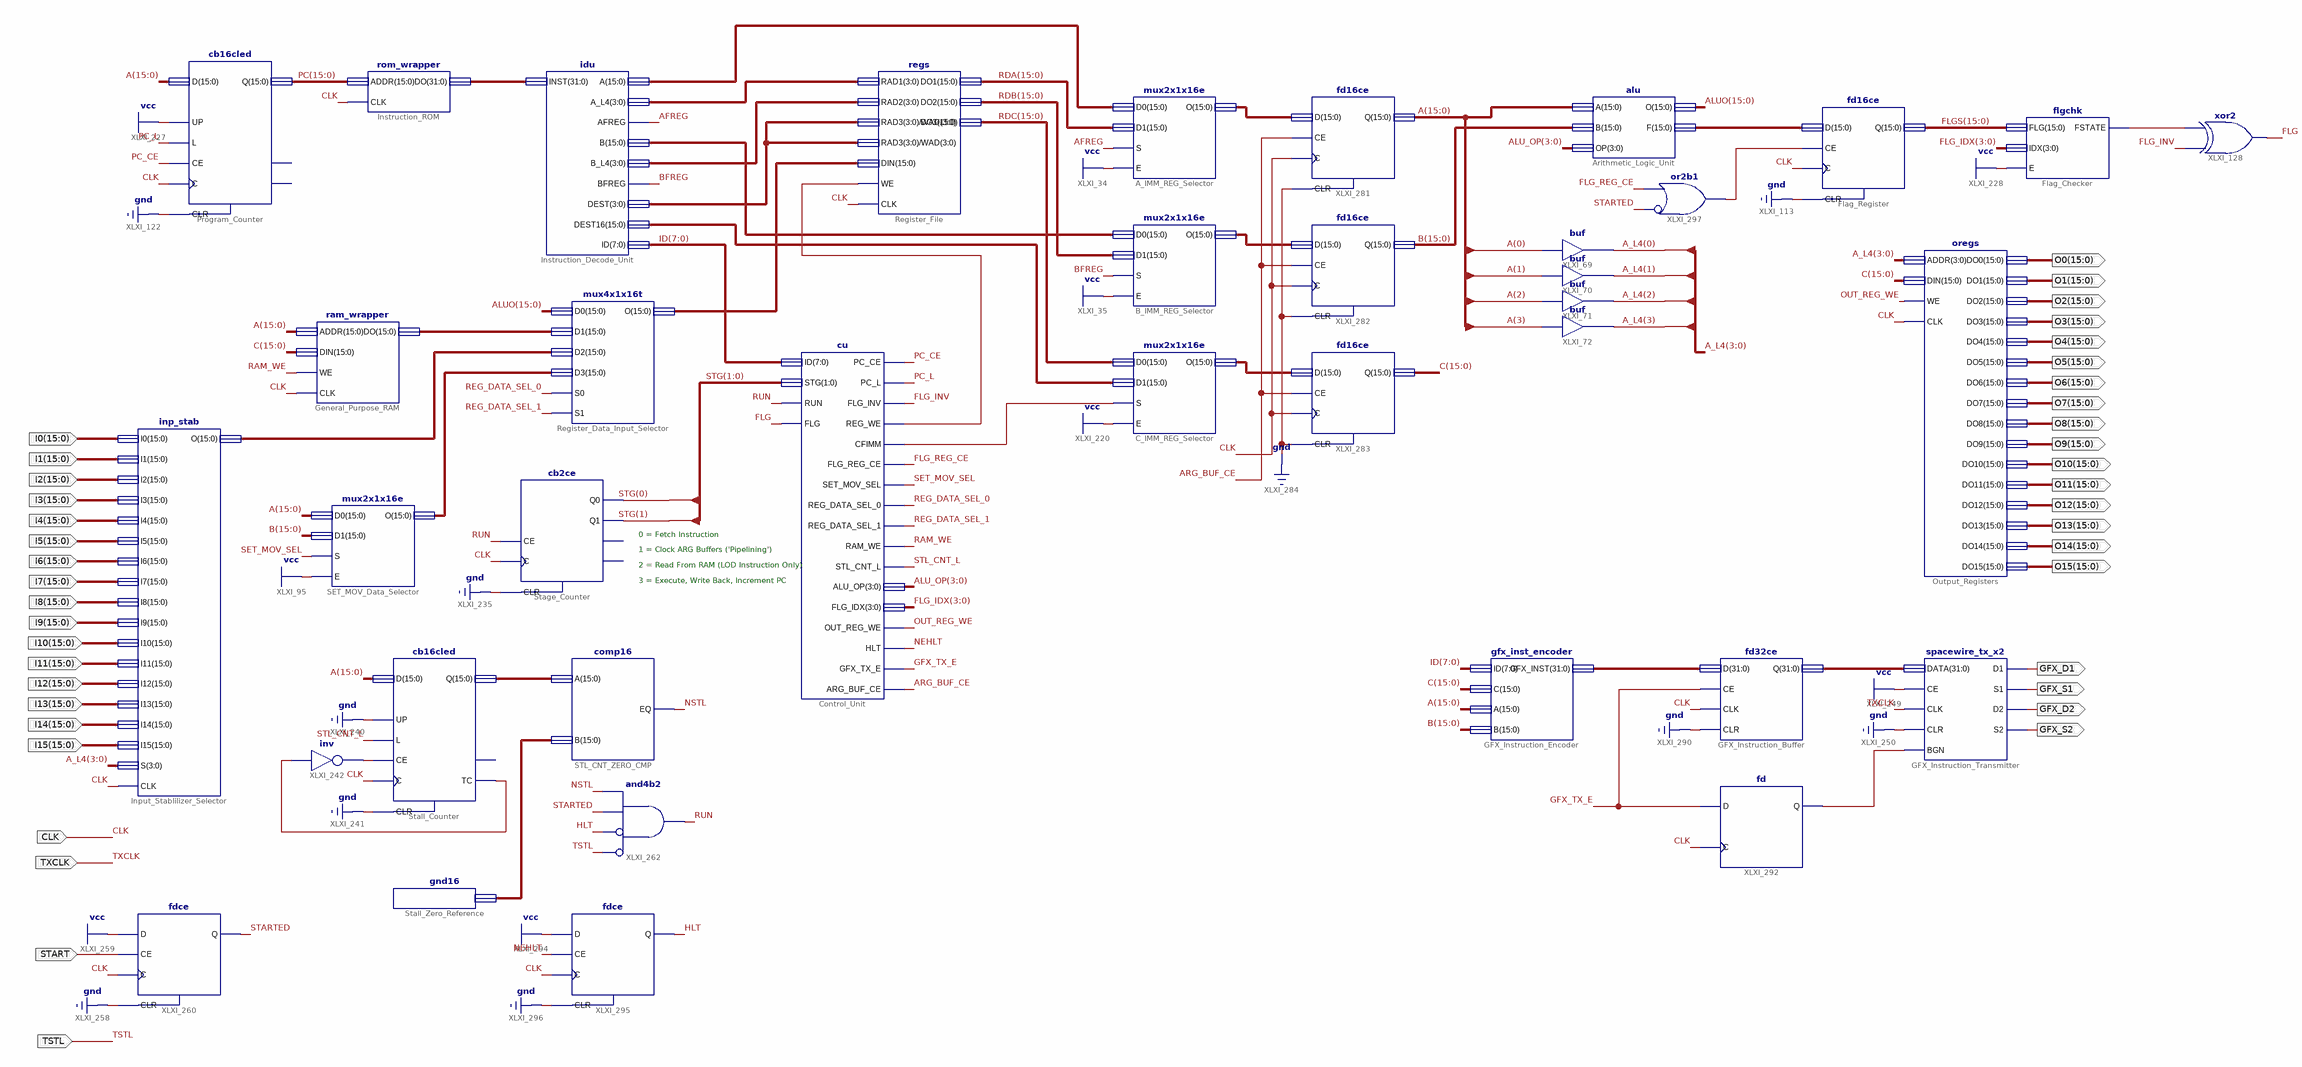
[diagram p0: schematic sheet 1]
// Xilinx ISE schematic cpu.sch (spartan6) as structural Verilog: 37 symbols, 42 ports
module cpu (
  input  [15:0] I0,
  input  [15:0] I1,
  input  [15:0] I10,
  input  [15:0] I11,
  input  [15:0] I12,
  input  [15:0] I13,
  input  [15:0] I14,
  input  [15:0] I15,
  input  [15:0] I2,
  input  [15:0] I3,
  input  [15:0] I4,
  input  [15:0] I5,
  input  [15:0] I6,
  input  [15:0] I7,
  input  [15:0] I8,
  input  [15:0] I9,
  input  CLK,
  input  TXCLK,
  input  START,
  input  TSTL,
  output [3:0] FLG_IDX,
  output [15:0] O0,
  output [15:0] O1,
  output [15:0] O10,
  output [15:0] O11,
  output [15:0] O12,
  output [15:0] O13,
  output [15:0] O14,
  output [15:0] O15,
  output [15:0] O2,
  output [15:0] O3,
  output [15:0] O4,
  output [15:0] O5,
  output [15:0] O6,
  output [15:0] O7,
  output [15:0] O8,
  output [15:0] O9,
  output GFX_S2,
  output GFX_D2,
  output GFX_S1,
  output GFX_D1,
  output [15:0] FLGS
);

  wire AFREG, ARG_BUF_CE, BFREG, FLG, FLG_INV, FLG_REG_CE, GFX_TX_E, HLT, NEHLT, NSTL, OUT_REG_WE, PC_CE,
       PC_L, RAM_WE, REG_DATA_SEL_0, REG_DATA_SEL_1, RUN, SET_MOV_SEL, STARTED, STL_CNT_L, XLXN_370,
       XLXN_696, XLXN_697, XLXN_728, XLXN_729, XLXN_848, XLXN_855;
  wire [1:0] STG;
  wire [3:0] A_L4, ALU_OP, XLXN_296, XLXN_303, XLXN_344;
  wire [7:0] ID;
  wire [15:0] A, ALUO, B, C, PC, RDA, RDB, RDC, XLXN_1, XLXN_30, XLXN_32, XLXN_58, XLXN_59, XLXN_60,
       XLXN_307, XLXN_348, XLXN_687, XLXN_762, XLXN_817, XLXN_818, XLXN_819;
  wire [31:0] XLXN_86, XLXN_837, XLXN_849;

  mux2x1x16e A_IMM_REG_Selector (.D0(XLXN_30), .D1(RDA), .E(1'b1), .O(XLXN_819), .S(AFREG));
  mux2x1x16e B_IMM_REG_Selector (.D0(XLXN_32), .D1(RDB), .E(1'b1), .O(XLXN_818), .S(BFREG));
  regs Register_File (
    .CLK(CLK), .DIN(XLXN_307), .DO1(RDA), .DO2(RDB), .DO3(RDC), .RAD1(XLXN_296), .RAD2(XLXN_303),
    .RAD3(XLXN_344), .WAD(XLXN_344), .WE(XLXN_728));
  mux2x1x16e C_IMM_REG_Selector (.D0(RDC), .D1(XLXN_348), .E(1'b1), .O(XLXN_817), .S(XLXN_729));
  cb16cled Program_Counter (.C(CLK), .CE(PC_CE), .CLR(1'b0), .D(A), .L(PC_L), .UP(1'b1), .Q(PC));  // open: CEO, TC
  idu Instruction_Decode_Unit (
    .A(XLXN_30), .AFREG(AFREG), .A_L4(XLXN_296), .B(XLXN_32), .BFREG(BFREG), .B_L4(XLXN_303),
    .DEST(XLXN_344), .DEST16(XLXN_348), .ID(ID), .INST(XLXN_86));
  mux4x1x16t Register_Data_Input_Selector (
    .D0(ALUO), .D1(XLXN_58), .D2(XLXN_59), .D3(XLXN_60), .O(XLXN_307), .S0(REG_DATA_SEL_0),
    .S1(REG_DATA_SEL_1));
  mux2x1x16e SET_MOV_Data_Selector (.D0(A), .D1(B), .E(1'b1), .O(XLXN_60), .S(SET_MOV_SEL));
  cb2ce Stage_Counter (.C(CLK), .CE(RUN), .CLR(1'b0), .Q0(STG[0]), .Q1(STG[1]));  // open: CEO, TC
  cb16cled Stall_Counter (
    .C(CLK), .CE(XLXN_696), .CLR(1'b0), .D(A), .L(STL_CNT_L), .UP(1'b0), .Q(XLXN_687), .TC(XLXN_697));  // open: CEO
  not XLXI_242 (XLXN_696, XLXN_697);
  comp16 STL_CNT_ZERO_CMP (.A(XLXN_687), .B(XLXN_762), .EQ(NSTL));
  gnd16 Stall_Zero_Reference (.GNDO(XLXN_762));
  fdce XLXI_260 (.C(CLK), .CE(START), .CLR(1'b0), .D(1'b1), .Q(STARTED));
  and XLXI_262 (RUN, ~TSTL, ~HLT, STARTED, NSTL);  // and4b2
  inp_stab Input_Stablilizer_Selector (
    .CLK(CLK), .I0(I0), .I1(I1), .I10(I10), .I11(I11), .I12(I12), .I13(I13), .I14(I14), .I15(I15), .I2(I2),
    .I3(I3), .I4(I4), .I5(I5), .I6(I6), .I7(I7), .I8(I8), .I9(I9), .O(XLXN_59), .S(A_L4));
  rom_wrapper Instruction_ROM (.ADDR(PC), .CLK(CLK), .DO(XLXN_86));
  ram_wrapper General_Purpose_RAM (.ADDR(A), .CLK(CLK), .DIN(C), .DO(XLXN_58), .WE(RAM_WE));
  alu Arithmetic_Logic_Unit (.A(A), .B(B), .F(XLXN_1), .O(ALUO), .OP(ALU_OP));
  fd16ce Flag_Register (.C(CLK), .CE(XLXN_855), .CLR(1'b0), .D(XLXN_1), .Q(FLGS));
  flgchk Flag_Checker (.E(1'b1), .FLG(FLGS), .FSTATE(XLXN_370), .IDX(FLG_IDX));
  xor XLXI_128 (FLG, FLG_INV, XLXN_370);
  oregs Output_Registers (
    .ADDR(A_L4), .CLK(CLK), .DIN(C), .DO0(O0), .DO1(O1), .DO10(O10), .DO11(O11), .DO12(O12), .DO13(O13),
    .DO14(O14), .DO15(O15), .DO2(O2), .DO3(O3), .DO4(O4), .DO5(O5), .DO6(O6), .DO7(O7), .DO8(O8), .DO9(O9),
    .WE(OUT_REG_WE));
  fd16ce XLXI_281 (.C(CLK), .CE(ARG_BUF_CE), .CLR(1'b0), .D(XLXN_819), .Q(A));
  fd16ce XLXI_282 (.C(CLK), .CE(ARG_BUF_CE), .CLR(1'b0), .D(XLXN_818), .Q(B));
  fd16ce XLXI_283 (.C(CLK), .CE(ARG_BUF_CE), .CLR(1'b0), .D(XLXN_817), .Q(C));
  cu Control_Unit (
    .ALU_OP(ALU_OP), .ARG_BUF_CE(ARG_BUF_CE), .CFIMM(XLXN_729), .FLG(FLG), .FLG_IDX(FLG_IDX),
    .FLG_INV(FLG_INV), .FLG_REG_CE(FLG_REG_CE), .GFX_TX_E(GFX_TX_E), .HLT(NEHLT), .ID(ID),
    .OUT_REG_WE(OUT_REG_WE), .PC_CE(PC_CE), .PC_L(PC_L), .RAM_WE(RAM_WE), .REG_DATA_SEL_0(REG_DATA_SEL_0),
    .REG_DATA_SEL_1(REG_DATA_SEL_1), .REG_WE(XLXN_728), .RUN(RUN), .SET_MOV_SEL(SET_MOV_SEL), .STG(STG),
    .STL_CNT_L(STL_CNT_L));
  fd32ce GFX_Instruction_Buffer (.CE(GFX_TX_E), .CLK(CLK), .CLR(1'b0), .D(XLXN_837), .Q(XLXN_849));
  gfx_inst_encoder GFX_Instruction_Encoder (.A(A), .B(B), .C(C), .GFX_INST(XLXN_837), .ID(ID));
  fd XLXI_292 (.C(CLK), .D(GFX_TX_E), .Q(XLXN_848));
  fdce XLXI_295 (.C(CLK), .CE(NEHLT), .CLR(1'b0), .D(1'b1), .Q(HLT));
  or XLXI_297 (XLXN_855, ~STARTED, FLG_REG_CE);  // or2b1
  buf XLXI_69 (A_L4[0], A[0]);
  buf XLXI_70 (A_L4[1], A[1]);
  buf XLXI_71 (A_L4[2], A[2]);
  buf XLXI_72 (A_L4[3], A[3]);
  spacewire_tx_x2 GFX_Instruction_Transmitter (
    .BGN(XLXN_848), .CE(1'b1), .CLK(TXCLK), .CLR(1'b0), .D1(GFX_D1), .D2(GFX_D2), .DATA(XLXN_849),
    .S1(GFX_S1), .S2(GFX_S2));

  // Notes on the sheet:
  //   0 = Fetch Instruction
  //   1 = Clock ARG Buffers ('Pipelining')
  //   2 = Read From RAM (LOD Instruction Only)
  //   3 = Execute, Write Back, Increment PC
endmodule
